# EAGLE design old_smart_nodemcu_reroute (EAGLE 7.6.0)
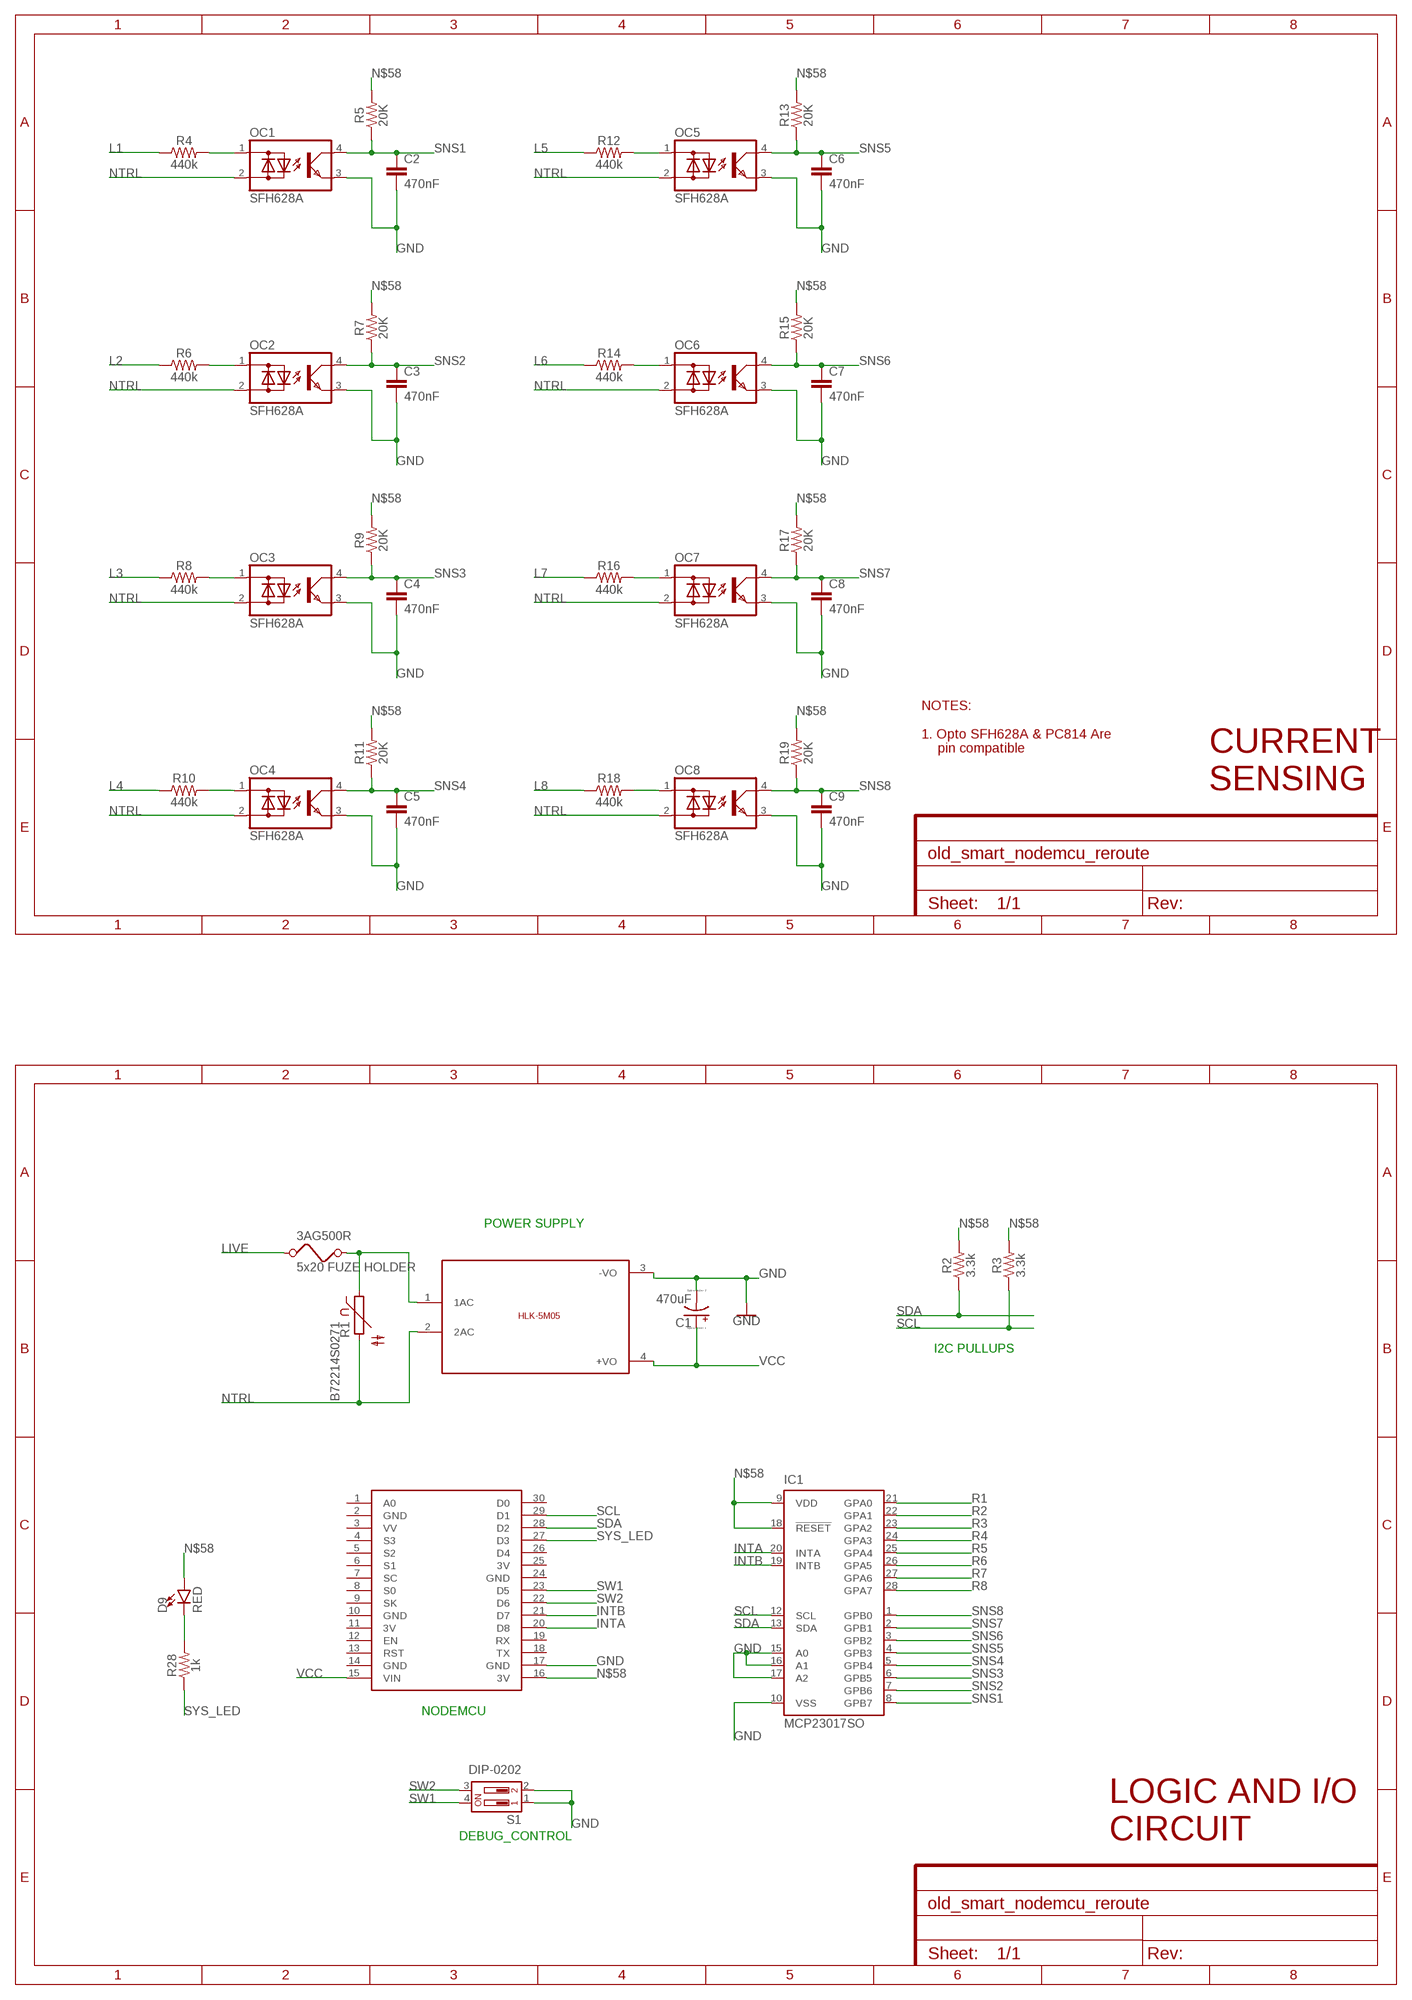
[diagram p0: schematic, sheet 1, part 1 of 2]
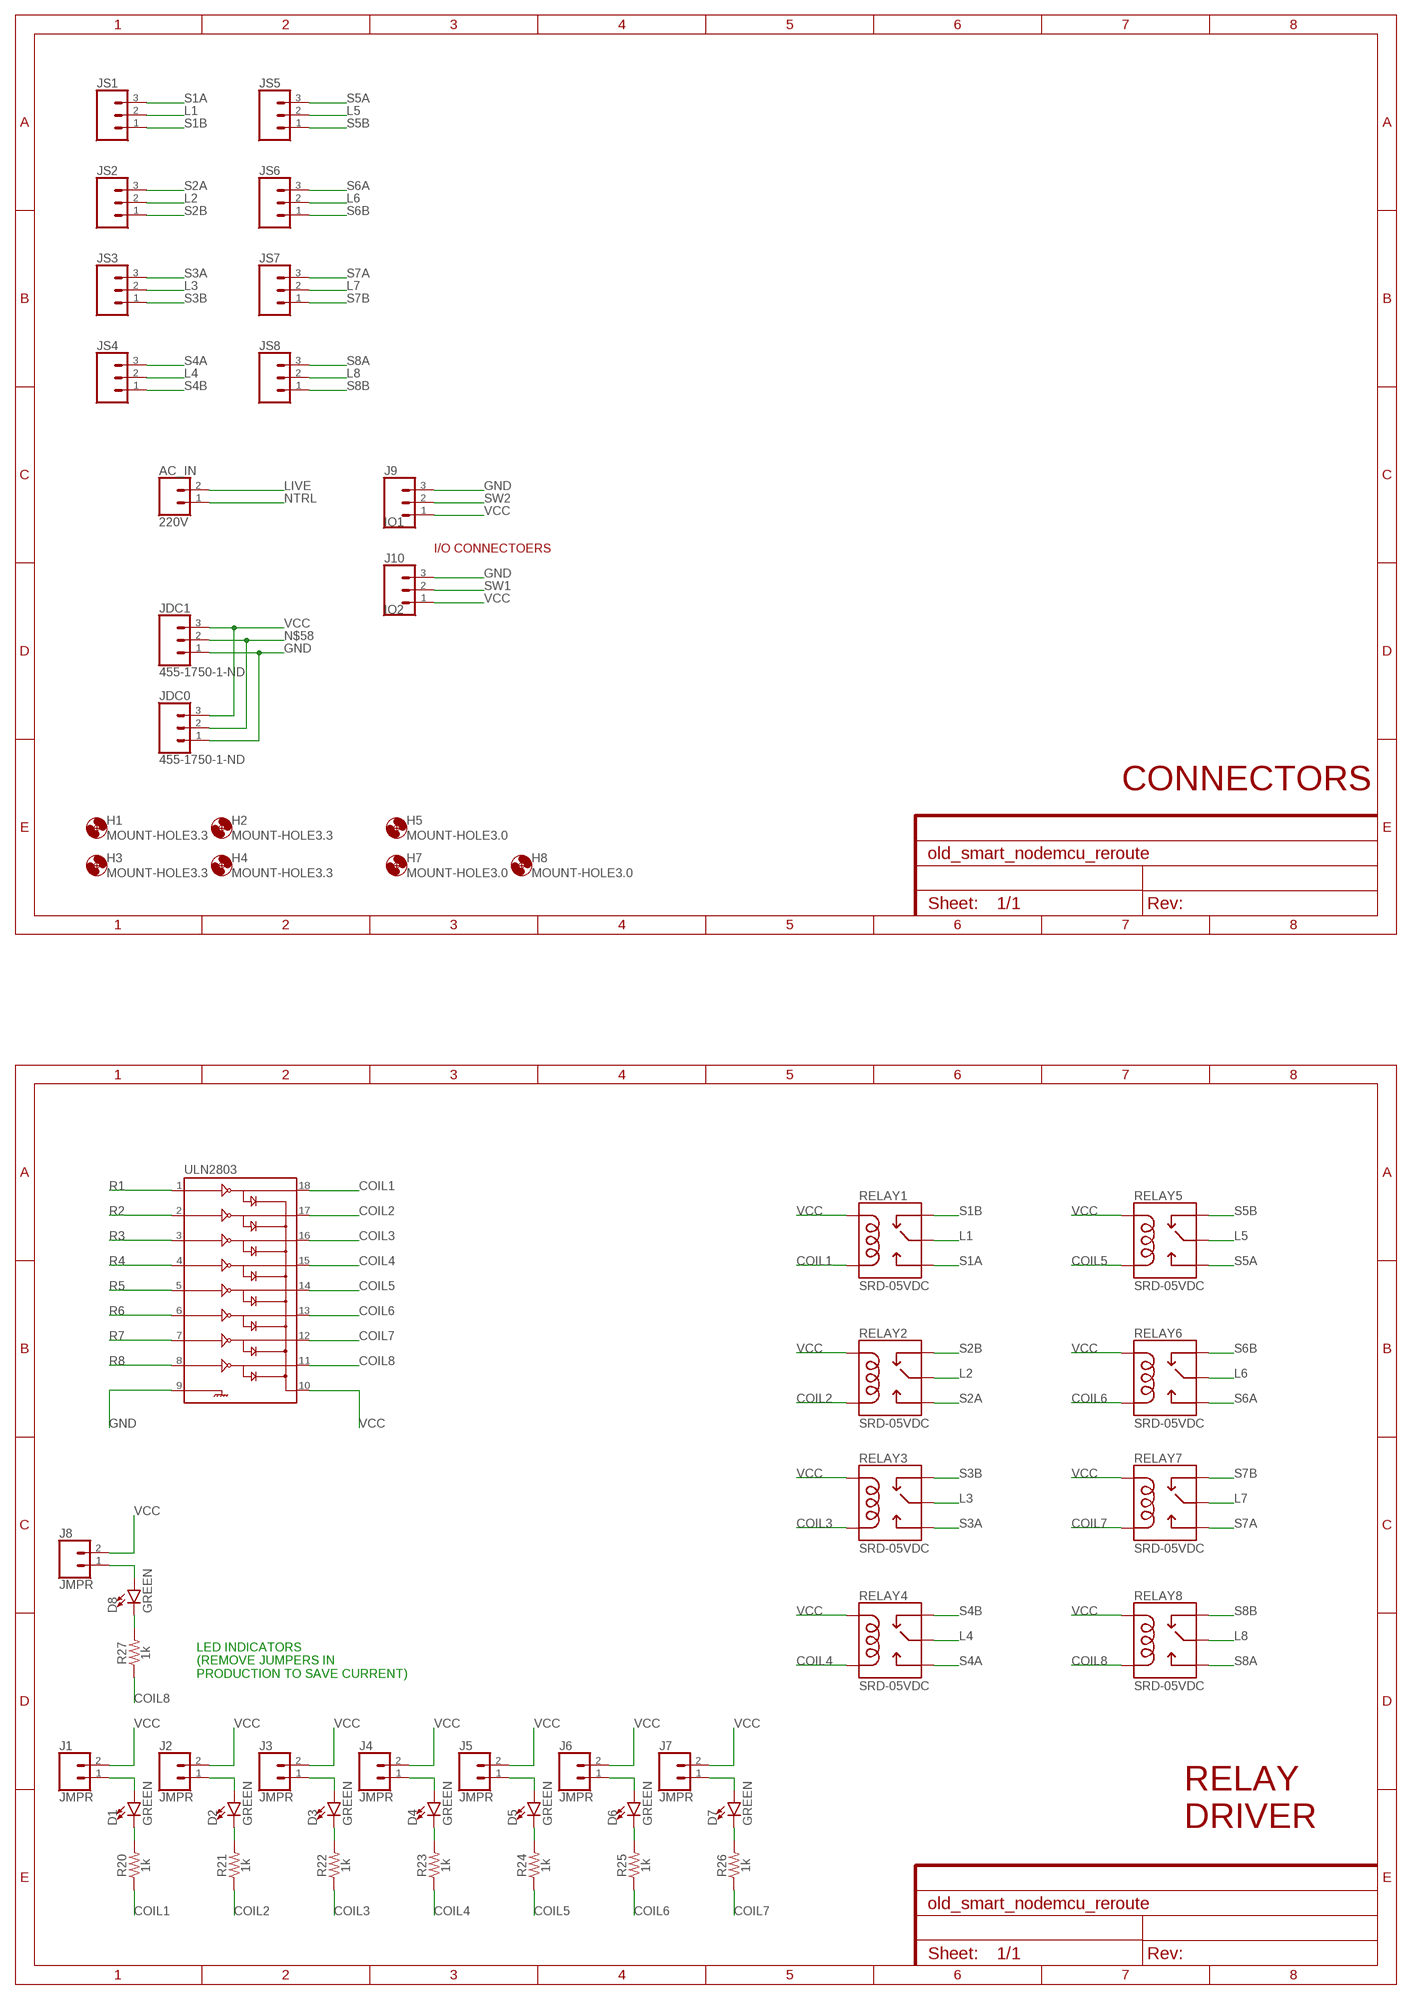
[diagram p1: schematic, sheet 1, part 2 of 2]

## Parts
3AG500R  5x20 FUZE HOLDER  FUSE  [FUSE]
AC_IN  220V  CONN_025MM  [SCREWTERMINAL-5MM-2]
C1  470uF  CPOL-USE3.5-8  [E3,5-8]
C2  470nF  470NF-0603-10V-10%-X5R  [0603]
C3  470nF  470NF-0603-10V-10%-X5R  [0603]
C4  470nF  470NF-0603-10V-10%-X5R  [0603]
C5  470nF  470NF-0603-10V-10%-X5R  [0603]
C6  470nF  470NF-0603-10V-10%-X5R  [0603]
C7  470nF  470NF-0603-10V-10%-X5R  [0603]
C8  470nF  470NF-0603-10V-10%-X5R  [0603]
C9  470nF  470NF-0603-10V-10%-X5R  [0603]
D1  GREEN  LED-GREEN0603  [LED-0603]
D2  GREEN  LED-GREEN0603  [LED-0603]
D3  GREEN  LED-GREEN0603  [LED-0603]
D4  GREEN  LED-GREEN0603  [LED-0603]
D5  GREEN  LED-GREEN0603  [LED-0603]
D6  GREEN  LED-GREEN0603  [LED-0603]
D7  GREEN  LED-GREEN0603  [LED-0603]
D8  GREEN  LED-GREEN0603  [LED-0603]
D9  RED  LED-RED0603  [LED-0603]
H1  MOUNT-HOLE3.3  [3,3]
H2  MOUNT-HOLE3.3  [3,3]
H3  MOUNT-HOLE3.3  [3,3]
H4  MOUNT-HOLE3.3  [3,3]
H5  MOUNT-HOLE3.0  [3,0]
H7  MOUNT-HOLE3.0  [3,0]
H8  MOUNT-HOLE3.0  [3,0]
IC1  MCP23017SO  [SO28W]
J1  JMPR  CONN_02  [1X02]
J2  JMPR  CONN_02  [1X02]
J3  JMPR  CONN_02  [1X02]
J4  JMPR  CONN_02  [1X02]
J5  JMPR  CONN_02  [1X02]
J6  JMPR  CONN_02  [1X02]
J7  JMPR  CONN_02  [1X02]
J8  JMPR  CONN_02  [1X02]
J9  IO1  CONN_03  [1X03]
J10  IO2  CONN_03  [1X03]
JDC0  455-1750-1-ND  CONN_03  [1X03]
JDC1  455-1750-1-ND  CONN_03  [1X03]
JS1  CONN_03-SCREW-5MM  [SCREWTERMINAL-5MM-3]
JS2  CONN_03-SCREW-5MM  [SCREWTERMINAL-5MM-3]
JS3  CONN_03-SCREW-5MM  [SCREWTERMINAL-5MM-3]
JS4  CONN_03-SCREW-5MM  [SCREWTERMINAL-5MM-3]
JS5  CONN_03-SCREW-5MM  [SCREWTERMINAL-5MM-3]
JS6  CONN_03-SCREW-5MM  [SCREWTERMINAL-5MM-3]
JS7  CONN_03-SCREW-5MM  [SCREWTERMINAL-5MM-3]
JS8  CONN_03-SCREW-5MM  [SCREWTERMINAL-5MM-3]
NODEMCU  NODEMCU  [NODEMCU]
OC1  SFH628A  SFH6206  [DIL4-SMD]
OC2  SFH628A  SFH6206  [DIL4-SMD]
OC3  SFH628A  SFH6206  [DIL4-SMD]
OC4  SFH628A  SFH6206  [DIL4-SMD]
OC5  SFH628A  SFH6206  [DIL4-SMD]
OC6  SFH628A  SFH6206  [DIL4-SMD]
OC7  SFH628A  SFH6206  [DIL4-SMD]
OC8  SFH628A  SFH6206  [DIL4-SMD]
R1  B72214S0271  P592  [P592]
R2  3.3k  3.3KOHM-0603-1/10W-1%  [0603]
R3  3.3k  3.3KOHM-0603-1/10W-1%  [0603]
R4  440k  RESISTOR0805  [0805]
R5  20K  10KOHM-0603-1/10W-1%  [0603]
R6  440k  RESISTOR0805  [0805]
R7  20K  10KOHM-0603-1/10W-1%  [0603]
R8  440k  RESISTOR0805  [0805]
R9  20K  10KOHM-0603-1/10W-1%  [0603]
R10  440k  RESISTOR0805  [0805]
R11  20K  10KOHM-0603-1/10W-1%  [0603]
R12  440k  RESISTOR0805  [0805]
R13  20K  10KOHM-0603-1/10W-1%  [0603]
R14  440k  RESISTOR0805  [0805]
R15  20K  10KOHM-0603-1/10W-1%  [0603]
R16  440k  RESISTOR0805  [0805]
R17  20K  10KOHM-0603-1/10W-1%  [0603]
R18  440k  RESISTOR0805  [0805]
R19  20K  10KOHM-0603-1/10W-1%  [0603]
R20  1k  1KOHM-0603-1/10W-1%  [0603]
R21  1k  1KOHM-0603-1/10W-1%  [0603]
R22  1k  1KOHM-0603-1/10W-1%  [0603]
R23  1k  1KOHM-0603-1/10W-1%  [0603]
R24  1k  1KOHM-0603-1/10W-1%  [0603]
R25  1k  1KOHM-0603-1/10W-1%  [0603]
R26  1k  1KOHM-0603-1/10W-1%  [0603]
R27  1k  1KOHM-0603-1/10W-1%  [0603]
R28  1k  1KOHM-0603-1/10W-1%  [0603]
RELAY1  SRD-05VDC  RELAYPTH  [SRD-05VDC-SL-C]
RELAY2  SRD-05VDC  RELAYPTH  [SRD-05VDC-SL-C]
RELAY3  SRD-05VDC  RELAYPTH  [SRD-05VDC-SL-C]
RELAY4  SRD-05VDC  RELAYPTH  [SRD-05VDC-SL-C]
RELAY5  SRD-05VDC  RELAYPTH  [SRD-05VDC-SL-C]
RELAY6  SRD-05VDC  RELAYPTH  [SRD-05VDC-SL-C]
RELAY7  SRD-05VDC  RELAYPTH  [SRD-05VDC-SL-C]
RELAY8  SRD-05VDC  RELAYPTH  [SRD-05VDC-SL-C]
S1  DIP-0202  [DIPSWITCH-02]
U$1  5VDC/5W  HLK-5M05  [HLK-5M05]
ULN2803  ULN2803SOICW  [SO18L]

## Nets
COIL1: R20.1 RELAY1.COIL0 ULN2803.18
COIL2: R21.1 RELAY2.COIL0 ULN2803.17
COIL3: R22.1 RELAY3.COIL0 ULN2803.16
COIL4: R23.1 RELAY4.COIL0 ULN2803.15
COIL5: R24.1 RELAY5.COIL0 ULN2803.14
COIL6: R25.1 RELAY6.COIL0 ULN2803.13
COIL7: R26.1 RELAY7.COIL0 ULN2803.12
COIL8: R27.1 RELAY8.COIL0 ULN2803.11
GND: C1.- C2.2 C3.2 C4.2 C5.2 C6.2 C7.2 C8.2 C9.2 IC1.10(VSS) IC1.15(A0) IC1.16(A1) IC1.17(A2) J9.3 J10.3 JDC0.1 JDC1.1 NODEMCU.17(GND) OC1.3(E) OC2.3(E) OC3.3(E) OC4.3(E) OC5.3(E) OC6.3(E) OC7.3(E) OC8.3(E) S1.1 S1.2 U$1.3(-VO) ULN2803.9
INTA: IC1.20(INTA) NODEMCU.20(D8)
INTB: IC1.19(INTB) NODEMCU.21(D7)
L1: JS1.2 R4.1 RELAY1.SWCOMMON
L2: JS2.2 R6.1 RELAY2.SWCOMMON
L3: JS3.2 R8.1 RELAY3.SWCOMMON
L4: JS4.2 R10.1 RELAY4.SWCOMMON
L5: JS5.2 R12.1 RELAY5.SWCOMMON
L6: JS6.2 R14.1 RELAY6.SWCOMMON
L7: JS7.2 R16.1 RELAY7.SWCOMMON
L8: JS8.2 R18.1 RELAY8.SWCOMMON
LIVE: 3AG500R.1 AC_IN.2
LIVE_FUSE: 3AG500R.2 R1.1 U$1.1(1AC)
N$1: OC1.1(AC1) R4.2
N$2: OC2.1(AC1) R6.2
N$3: OC3.1(AC1) R8.2
N$5: D1.A J1.1
N$6: OC5.1(AC1) R12.2
N$7: OC6.1(AC1) R14.2
N$8: OC7.1(AC1) R16.2
N$9: OC4.1(AC1) R10.2
N$10: OC8.1(AC1) R18.2
N$11: D1.C R20.2
N$12: D2.A J2.1
N$13: D2.C R21.2
N$14: D3.A J3.1
N$15: D3.C R22.2
N$16: D4.A J4.1
N$17: D4.C R23.2
N$18: D5.A J5.1
N$19: D5.C R24.2
N$20: D6.A J6.1
N$21: D6.C R25.2
N$22: D7.A J7.1
N$23: D7.C R26.2
N$24: D8.A J8.1
N$25: D8.C R27.2
N$26: D9.C R28.2
N$58: D9.A IC1.9(VDD) IC1.18(!RESET) JDC0.2 JDC1.2 NODEMCU.16(3V) R2.2 R3.2 R5.2 R7.2 R9.2 R11.2 R13.2 R15.2 R17.2 R19.2
NTRL: AC_IN.1 OC1.2(AC2) OC2.2(AC2) OC3.2(AC2) OC4.2(AC2) OC5.2(AC2) OC6.2(AC2) OC7.2(AC2) OC8.2(AC2) R1.2 U$1.2(2AC)
R1: IC1.21(GPA0) ULN2803.1
R2: IC1.22(GPA1) ULN2803.2
R3: IC1.23(GPA2) ULN2803.3
R4: IC1.24(GPA3) ULN2803.4
R5: IC1.25(GPA4) ULN2803.5
R6: IC1.26(GPA5) ULN2803.6
R7: IC1.27(GPA6) ULN2803.7
R8: IC1.28(GPA7) ULN2803.8
S1A: JS1.3 RELAY1.SWOPEN
S1B: JS1.1 RELAY1.SWCLOSED(SWCLOSE)
S2A: JS2.3 RELAY2.SWOPEN
S2B: JS2.1 RELAY2.SWCLOSED(SWCLOSE)
S3A: JS3.3 RELAY3.SWOPEN
S3B: JS3.1 RELAY3.SWCLOSED(SWCLOSE)
S4A: JS4.3 RELAY4.SWOPEN
S4B: JS4.1 RELAY4.SWCLOSED(SWCLOSE)
S5A: JS5.3 RELAY5.SWOPEN
S5B: JS5.1 RELAY5.SWCLOSED(SWCLOSE)
S6A: JS6.3 RELAY6.SWOPEN
S6B: JS6.1 RELAY6.SWCLOSED(SWCLOSE)
S7A: JS7.3 RELAY7.SWOPEN
S7B: JS7.1 RELAY7.SWCLOSED(SWCLOSE)
S8A: JS8.3 RELAY8.SWOPEN
S8B: JS8.1 RELAY8.SWCLOSED(SWCLOSE)
SCL: IC1.12(SCL) NODEMCU.29(D1) R3.1
SDA: IC1.13(SDA) NODEMCU.28(D2) R2.1
SNS1: C2.1 IC1.8(GPB7) OC1.4(C) R5.1
SNS2: C3.1 IC1.7(GPB6) OC2.4(C) R7.1
SNS3: C4.1 IC1.6(GPB5) OC3.4(C) R9.1
SNS4: C5.1 IC1.5(GPB4) OC4.4(C) R11.1
SNS5: C6.1 IC1.4(GPB3) OC5.4(C) R13.1
SNS6: C7.1 IC1.3(GPB2) OC6.4(C) R15.1
SNS7: C8.1 IC1.2(GPB1) OC7.4(C) R17.1
SNS8: C9.1 IC1.1(GPB0) OC8.4(C) R19.1
SW1: J10.2 NODEMCU.23(D5) S1.4
SW2: J9.2 NODEMCU.22(D6) S1.3
SYS_LED: NODEMCU.27(D3) R28.1
VCC: C1.+ J1.2 J2.2 J3.2 J4.2 J5.2 J6.2 J7.2 J8.2 J9.1 J10.1 JDC0.3 JDC1.3 NODEMCU.15(VIN) RELAY1.COIL1 RELAY2.COIL1 RELAY3.COIL1 RELAY4.COIL1 RELAY5.COIL1 RELAY6.COIL1 RELAY7.COIL1 RELAY8.COIL1 U$1.4(+VO) ULN2803.10
Unconnected: NODEMCU.1(A0) NODEMCU.3(VV) NODEMCU.4(S3) NODEMCU.5(S2) NODEMCU.6(S1) NODEMCU.7(SC) NODEMCU.8(S0) NODEMCU.9(SK) NODEMCU.12(EN) NODEMCU.13(RST) NODEMCU.18(TX) NODEMCU.19(RX) NODEMCU.26(D4) NODEMCU.30(D0)

## Notes on the sheet
- I/O CONNECTOERS
- NOTES:
  
  1. Opto SFH628A & PC814 Are
      pin compatible
- CURRENT
  SENSING
- CONNECTORS
- POWER SUPPLY
- I2C PULLUPS
- LED INDICATORS
  (REMOVE JUMPERS IN 
  PRODUCTION TO SAVE CURRENT)
- NODEMCU
- RELAY
  DRIVER
- DEBUG_CONTROL
- LOGIC AND I/O
  CIRCUIT

## Power pins joined to a net without a drawn wire
3V: NODEMCU.11(3V) NODEMCU.25(3V)
GND: NODEMCU.2(GND) NODEMCU.10(GND) NODEMCU.14(GND) NODEMCU.24(GND)

## Library data of the parts
3AG500R = special:FUSE: FUSE 5 x 20 mm
AC_IN = SparkFun-Connectors:CONN_02: Multi connection point. Often used as Generic Header-pin footprint for 0.1 inch spaced/style header connections On any of the 0.1 inch spaced packages, you can populate with these: Break Away Headers - Straight <https://www.sparkfun.com/products/116> (PRT-00116) Break Away Male Headers - Right Angle <https://www.sparkfun.com/products/553> (PRT-00553) Female Headers <https://www.sparkfun.com/products/115> (PRT-00115) Break Away Headers - Machine Pin <https://www.sparkfun.com/products/117> (PRT-00117) Break Away Female Headers - Swiss Machine Pin <https://www.sparkfun.com/products/743> (PRT-00743) For SCREWTERMINALS and SPRING TERMINALS visit here: Screw Terimnals on SparkFun.com <https://www.sparkfun.com/search/results?term=Screw+Terminals> (5mm/3.5mm/2.54mm spacing) This device is also useful as a general connection point to wire up your design to another part of your project. Our various solder wires solder well into these plated through hole pads. Hook-Up Wire - Assortment (Stranded, 22 AWG) <https://www.sparkfun.com/products/11375> (PRT-11375) Hook-Up Wire - Assortment (Solid Core, 22 AWG) <https://www.sparkfun.com/products/11367> (PRT-11367) View the entire wire category on our website here <https://www.sparkfun.com/categories/141> Special notes: Molex polarized connector foot print use with: PRT-08233 with associated crimp pins and housings. 2.54_SCREWTERM for use with PRT-10571. 3.5mm Screw Terminal footprints for PRT-08084 5mm Screw Terminal footprints for use with PRT-08432; SF_SKU: PRT-08432
C1 = resistor:CPOL-US: POLARIZED CAPACITOR, American symbol
C2-C9 = SparkFun-Capacitors:470NF: 0.47uF/470nF ceramic capacitors A capacitor is a passive two-terminal electrical component used to store electrical energy temporarily in an electric field.; PROD_ID: CAP-13216
D1-D8 = SparkFun-LED:LED-GREEN: Green SMD LED Used in manufacturing of various products at SparkFun Packages: 0603 - SMD 0603 package [Product Link] <http://www.futureelectronics.com/en/technologies/semiconductors/optoelectronics/leds/Pages/9894312-LTST-C190GKT.aspx?CrossPart=HSMG-C190&IM=0> LilyPad 1206 - SMD1206 LilyPad package [Product Link] <http://www.futureelectronics.com/en/Technologies/Product.aspx?ProductID=IN150NGHARVATEKCORPORATION2049943&IM=0> 1206 - SMD1206 package [Product Link] <http://www.futureelectronics.com/en/technologies/semiconductors/optoelectronics/leds/Pages/8315665-LTST-C150KGKT.aspx?IM=0> 1206 Bottom Mount -SMD 1206 Bottom Mount [Product Link] <http://www.digikey.com/product-detail/en/lite-on-inc/LTST-C230KGKT/160-1456-1-ND/386854> SparkFun Products: Pro Mini 328 -5V <https://www.sparkfun.com/products/821> RedBoard <https://www.sparkfun.com/products/12757> MP3 Trigger <https://www.sparkfun.com/products/13720> Makey Makey <https://www.sparkfun.com/products/11076>; PROD_ID: DIO-00821
D9 = SparkFun-LED:LED-RED: Red SMD LED Used in manufacturing of most products at SparkFun Packages: 0603 - SMD 0603 package [Product Link] <http://docs.avagotech.com/docs/AV02-0551EN> 0603 SMART - SMD 0603 SMART package ( more efficient and expensive)[Product Link] <http://www.osram-os.com/Graphics/XPic2/00077099_0.pdf> 1206 - SMD1206 package [Product Link] <https://www.sparkfun.com/datasheets/DevTools/LilyPad/Q150OVS4.pdff> SparkFun Products: Pro Mini 328 -5V <https://www.sparkfun.com/products/821> RedBoard <https://www.sparkfun.com/products/12757> IOIO-OTG <https://www.sparkfun.com/products/13613>; PROD_ID: DIO-00819
H1-H5 H7 H8 = holes:MOUNT-HOLE: MOUNTING HOLE with drill center marker
IC1 = microchip:MCP23017: http://ww1.microchip.com/downloads/en/DeviceDoc/21952a.pdf Source: http://ww1.microchip.com/downloads/en/DeviceDoc/21952a.pdf; MF: MICROCHIP; MPN: MCP23017-E/SO; OC_FARNELL: 1332087; OC_NEWARK: 31K2958
J1-J8 = SparkFun-Connectors:CONN_02: Multi connection point. Often used as Generic Header-pin footprint for 0.1 inch spaced/style header connections On any of the 0.1 inch spaced packages, you can populate with these: Break Away Headers - Straight <https://www.sparkfun.com/products/116> (PRT-00116) Break Away Male Headers - Right Angle <https://www.sparkfun.com/products/553> (PRT-00553) Female Headers <https://www.sparkfun.com/products/115> (PRT-00115) Break Away Headers - Machine Pin <https://www.sparkfun.com/products/117> (PRT-00117) Break Away Female Headers - Swiss Machine Pin <https://www.sparkfun.com/products/743> (PRT-00743) For SCREWTERMINALS and SPRING TERMINALS visit here: Screw Terimnals on SparkFun.com <https://www.sparkfun.com/search/results?term=Screw+Terminals> (5mm/3.5mm/2.54mm spacing) This device is also useful as a general connection point to wire up your design to another part of your project. Our various solder wires solder well into these plated through hole pads. Hook-Up Wire - Assortment (Stranded, 22 AWG) <https://www.sparkfun.com/products/11375> (PRT-11375) Hook-Up Wire - Assortment (Solid Core, 22 AWG) <https://www.sparkfun.com/products/11367> (PRT-11367) View the entire wire category on our website here <https://www.sparkfun.com/categories/141> Special notes: Molex polarized connector foot print use with: PRT-08233 with associated crimp pins and housings. 2.54_SCREWTERM for use with PRT-10571. 3.5mm Screw Terminal footprints for PRT-08084 5mm Screw Terminal footprints for use with PRT-08432
J9 J10 = SparkFun-Connectors:CONN_03: Multi connection point. Often used as Generic Header-pin footprint for 0.1 inch spaced/style header connections On any of the 0.1 inch spaced packages, you can populate with these: Break Away Headers - Straight <https://www.sparkfun.com/products/116> (PRT-00116) Break Away Male Headers - Right Angle <https://www.sparkfun.com/products/553> (PRT-00553) Female Headers <https://www.sparkfun.com/products/115> (PRT-00115) Break Away Headers - Machine Pin <https://www.sparkfun.com/products/117> (PRT-00117) Break Away Female Headers - Swiss Machine Pin <https://www.sparkfun.com/products/743> (PRT-00743) Stackable Header - 3 Pin (Female, 0.1") <https://www.sparkfun.com/products/13875> (PRT-13875) For SCREWTERMINALS and SPRING TERMINALS visit here: Screw Terimnals on SparkFun.com <https://www.sparkfun.com/search/results?term=Screw+Terminals> (5mm/3.5mm/2.54mm spacing) This device is also useful as a general connection point to wire up your design to another part of your project. Our various solder wires solder well into these plated through hole pads. Hook-Up Wire - Assortment (Stranded, 22 AWG) <https://www.sparkfun.com/products/11375> (PRT-11375) Hook-Up Wire - Assortment (Solid Core, 22 AWG) <https://www.sparkfun.com/products/11367> (PRT-11367) View the entire wire category on our website here <https://www.sparkfun.com/categories/141> Special notes: Molex polarized connector foot print use with SKU : PRT-08232 with associated crimp pins and housings.; PROD_ID: XXX-00000; VALUE: 455-1750-1-ND
JDC0 JDC1 = SparkFun-Connectors:CONN_03: Multi connection point. Often used as Generic Header-pin footprint for 0.1 inch spaced/style header connections On any of the 0.1 inch spaced packages, you can populate with these: Break Away Headers - Straight <https://www.sparkfun.com/products/116> (PRT-00116) Break Away Male Headers - Right Angle <https://www.sparkfun.com/products/553> (PRT-00553) Female Headers <https://www.sparkfun.com/products/115> (PRT-00115) Break Away Headers - Machine Pin <https://www.sparkfun.com/products/117> (PRT-00117) Break Away Female Headers - Swiss Machine Pin <https://www.sparkfun.com/products/743> (PRT-00743) Stackable Header - 3 Pin (Female, 0.1") <https://www.sparkfun.com/products/13875> (PRT-13875) For SCREWTERMINALS and SPRING TERMINALS visit here: Screw Terimnals on SparkFun.com <https://www.sparkfun.com/search/results?term=Screw+Terminals> (5mm/3.5mm/2.54mm spacing) This device is also useful as a general connection point to wire up your design to another part of your project. Our various solder wires solder well into these plated through hole pads. Hook-Up Wire - Assortment (Stranded, 22 AWG) <https://www.sparkfun.com/products/11375> (PRT-11375) Hook-Up Wire - Assortment (Solid Core, 22 AWG) <https://www.sparkfun.com/products/11367> (PRT-11367) View the entire wire category on our website here <https://www.sparkfun.com/categories/141> Special notes: Molex polarized connector foot print use with SKU : PRT-08232 with associated crimp pins and housings.; PROD_ID: XXX-00000
JS1-JS8 = SparkFun-Connectors:CONN_03: Multi connection point. Often used as Generic Header-pin footprint for 0.1 inch spaced/style header connections On any of the 0.1 inch spaced packages, you can populate with these: Break Away Headers - Straight <https://www.sparkfun.com/products/116> (PRT-00116) Break Away Male Headers - Right Angle <https://www.sparkfun.com/products/553> (PRT-00553) Female Headers <https://www.sparkfun.com/products/115> (PRT-00115) Break Away Headers - Machine Pin <https://www.sparkfun.com/products/117> (PRT-00117) Break Away Female Headers - Swiss Machine Pin <https://www.sparkfun.com/products/743> (PRT-00743) Stackable Header - 3 Pin (Female, 0.1") <https://www.sparkfun.com/products/13875> (PRT-13875) For SCREWTERMINALS and SPRING TERMINALS visit here: Screw Terimnals on SparkFun.com <https://www.sparkfun.com/search/results?term=Screw+Terminals> (5mm/3.5mm/2.54mm spacing) This device is also useful as a general connection point to wire up your design to another part of your project. Our various solder wires solder well into these plated through hole pads. Hook-Up Wire - Assortment (Stranded, 22 AWG) <https://www.sparkfun.com/products/11375> (PRT-11375) Hook-Up Wire - Assortment (Solid Core, 22 AWG) <https://www.sparkfun.com/products/11367> (PRT-11367) View the entire wire category on our website here <https://www.sparkfun.com/categories/141> Special notes: Molex polarized connector foot print use with SKU : PRT-08232 with associated crimp pins and housings.; PROD_ID: CONN-10134; SF_SKU: PRT-08433
NODEMCU = nodemcu:NODEMCU
OC1-OC8 = optocoupler:SFH620: Optocoupler, Phototransistor Output, AC Input Source: http://www.vishay.com/docs/83675/sfh620.pdf; MF: VISHAY/TELEFUNKEN; MPN: SFH6206-3; OC_FARNELL: 1469585; OC_NEWARK: 58K2214
R1 = varistor:P592: VARISTOR
R2 R3 = SparkFun-Resistors:3.3KOHM: 3.3kΩ resistor A resistor is a passive two-terminal electrical component that implements electrical resistance as a circuit element. Resistors act to reduce current flow, and, at the same time, act to lower voltage levels within circuits. - Wikipedia; PROD_ID: RES-07851
R4 R6 R8 R10 R12 R14 R16 R18 = SparkFun-Resistors:RESISTOR: Generic Resistor Package
R5 R7 R9 R11 R13 R15 R17 R19 = SparkFun-Resistors:10KOHM: 10kΩ resistor A resistor is a passive two-terminal electrical component that implements electrical resistance as a circuit element. Resistors act to reduce current flow, and, at the same time, act to lower voltage levels within circuits. - Wikipedia; PROD_ID: RES-00824; VALUE: 10k
R20-R28 = SparkFun-Resistors:1KOHM: 1kΩ resistor A resistor is a passive two-terminal electrical component that implements electrical resistance as a circuit element. Resistors act to reduce current flow, and, at the same time, act to lower voltage levels within circuits. - Wikipedia; PROD_ID: RES-07856
RELAY1-RELAY8 = SRD-05VDC:RELAY: SPDT relay (COM-00101)
S1 = SparkFun-Retired:DIP-02: SMD dip switch 2 positions
U$1 = HLK-M05:HLK-5M05: HLK-5M05 is an 5Volt/5W smps developed by HI-LINK; SIZE: 23x38(mm)
ULN2803 = SparkFun-IC-Special-Function:ULN2803: Darlington Driver(IC-07959, low stock) ULN2803 Darlington array. 500mA max per channel, 8-channel package. Spark Fun Electronics SKU : COM-00312

## Board
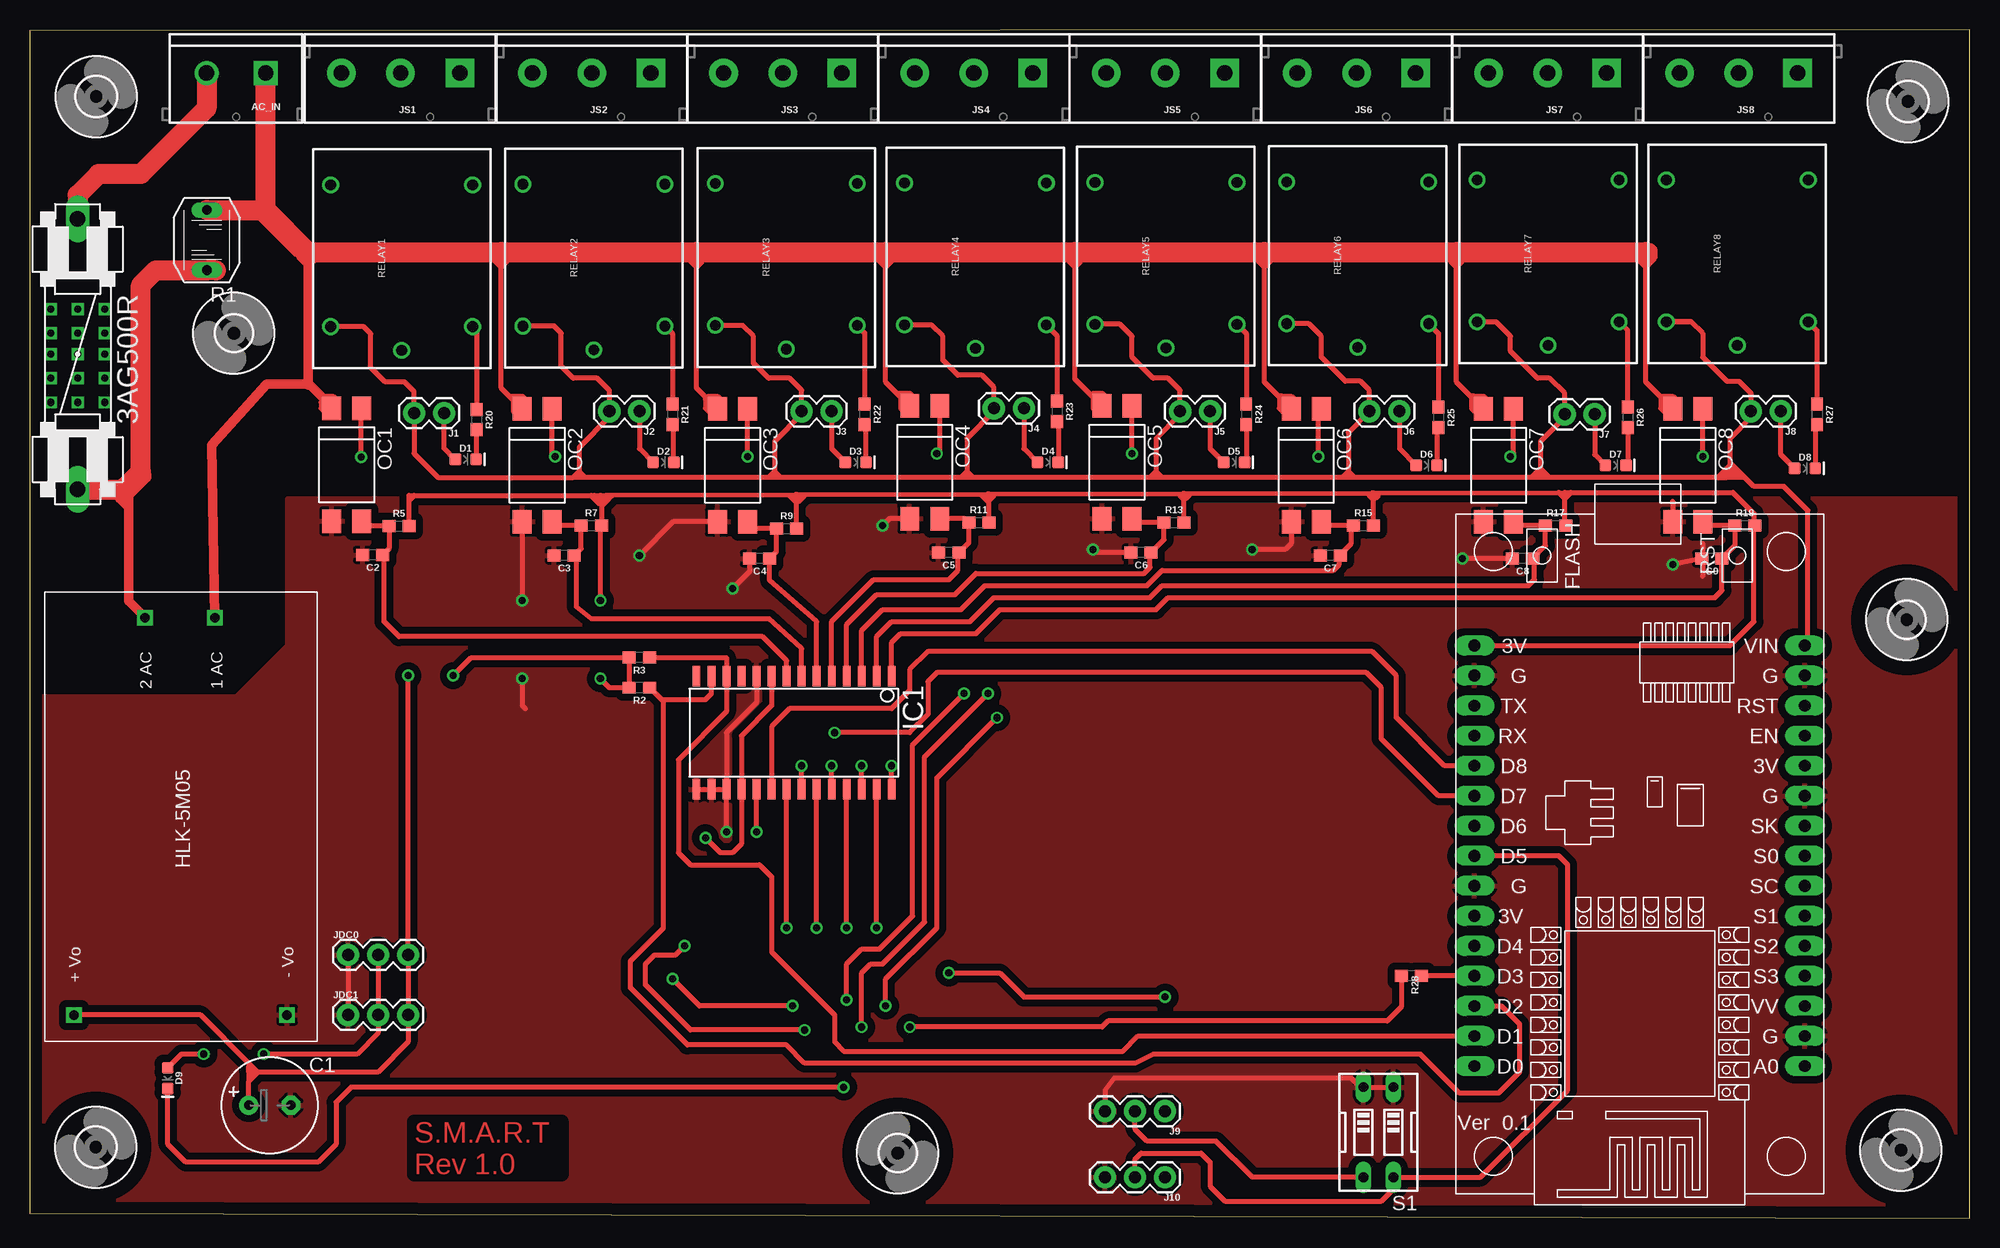
[diagram p2: board, top side]
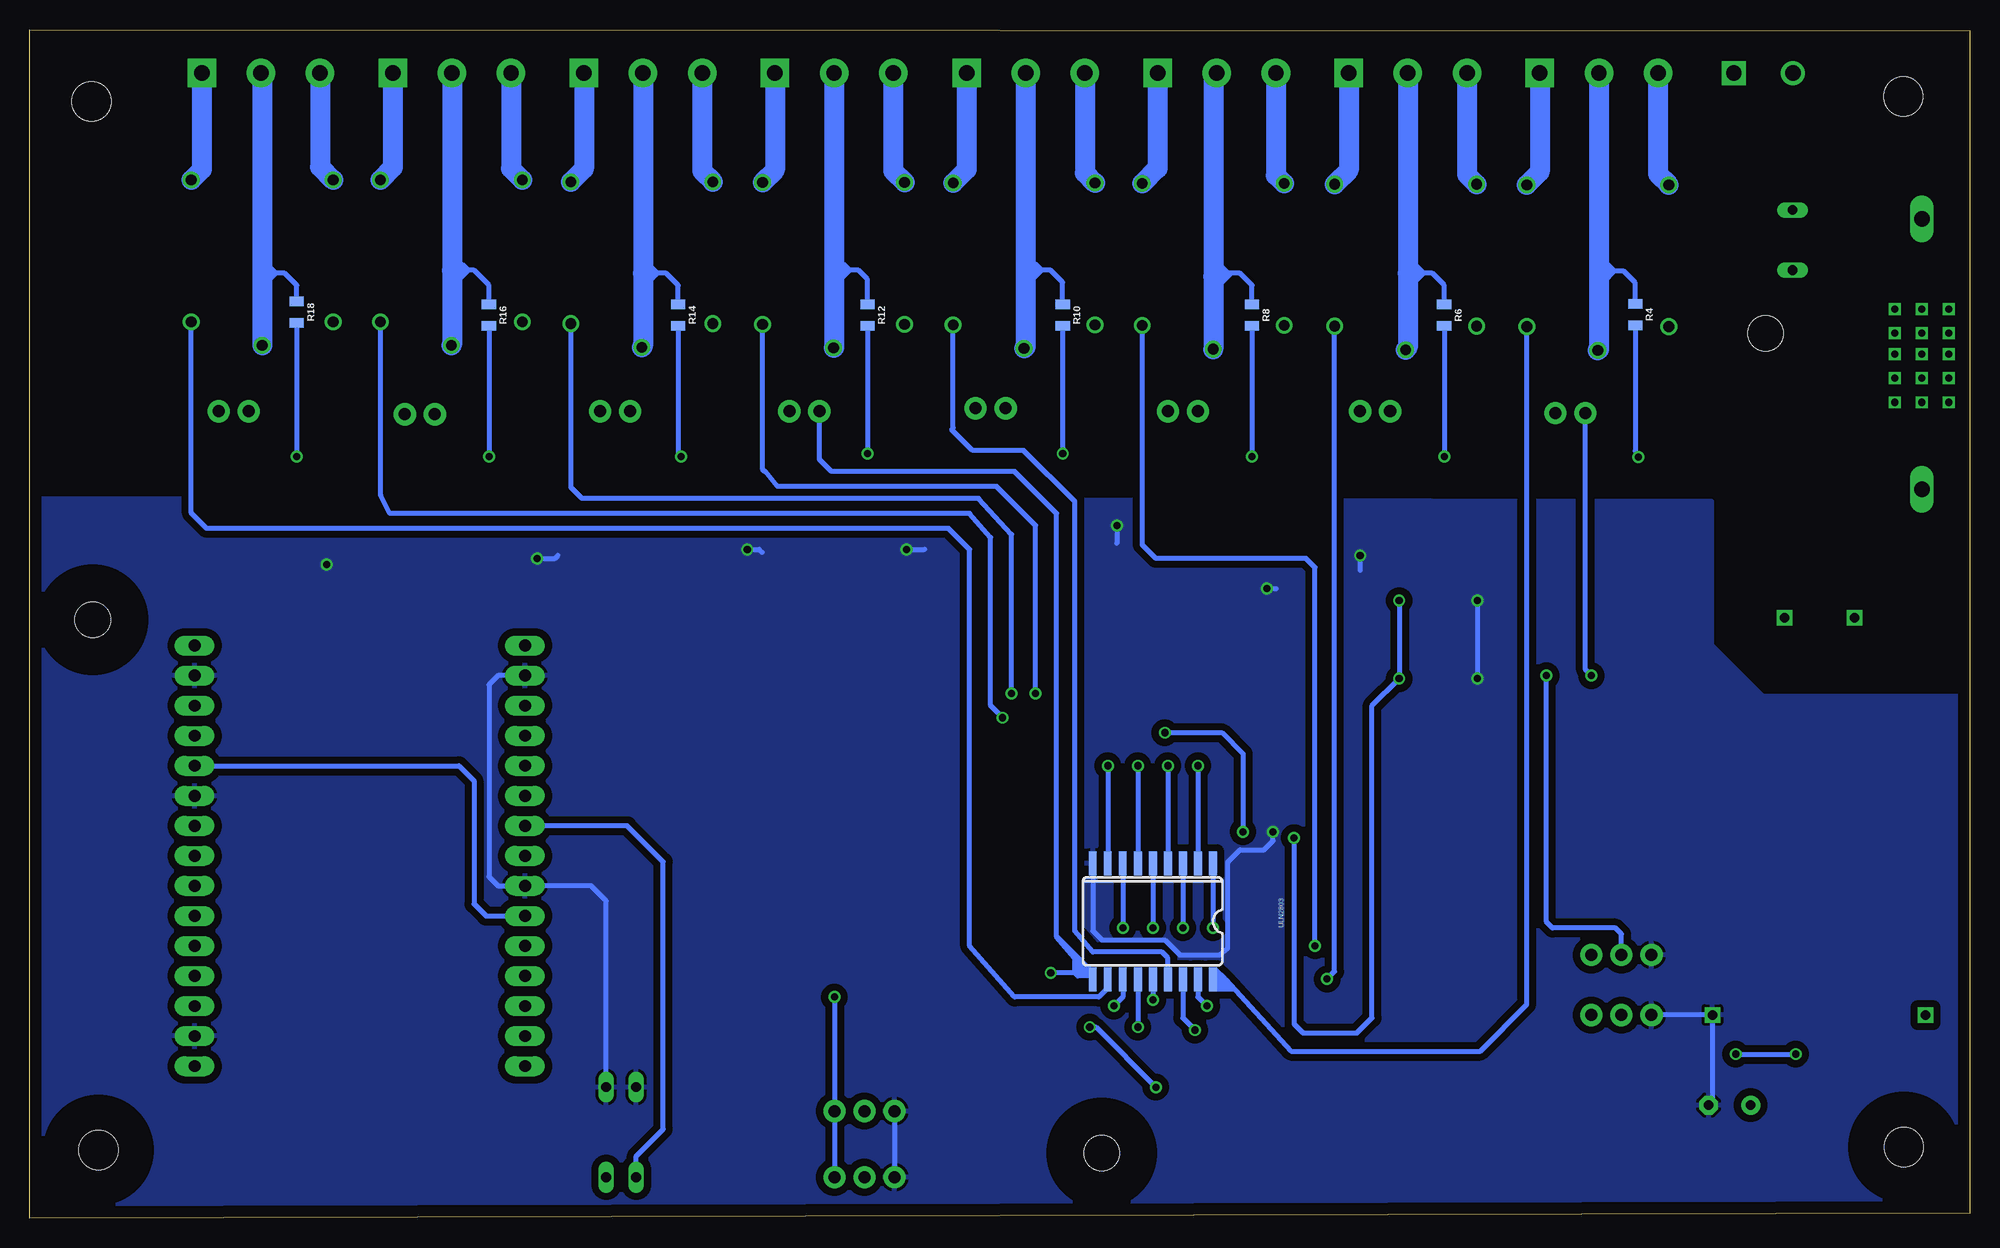
[diagram p3: board, bottom side, seen from below]

Size 164.06 x 100.51 mm. Coordinates in mm from the lower left corner, seen from the top.
Outline: 0,0.41 164.06,0 164.06,100.51 0,100.41 0,0.41
Copper layers (1*16): Top 0.035mm / dielectric 1.5mm / Bottom 0.035mm
Design rules "default": minimum track width 10mil, minimum drill 24mil, track to track 8mil, track to pad 8mil, pad to pad 8mil, via to via 8mil, smd to smd 8mil, copper to edge 40mil, drill to drill 8mil, minimum pad ring 10mil, minimum via ring 8mil, stop-mask expansion 4mil, vias tented up to drill 0mil, thermal gap 10mil

### Footprints (pad centres in the part's own frame; a part is rotated, then mirrored left to right if it is on the bottom)
FUSE = drill 1.321 long: 1 -11.43,0; 2 11.43,0
SCREWTERMINAL-5MM-2 = drill 1.3 pad 2.032 square: 1 0,0 | drill 1.3 pad 2.032: 2 5,0
E3,5-8 = drill 0.813 pad 1.6: + -1.778,0 | drill 0.813 pad 1.6 octagon: - 1.778,0
0603 = smd 1.1 x 1: 1 -0.85,0; 2 0.85,0
LED-0603 = smd 1 x 1: A -0.877,0; C 0.877,0
3,3 = hole 3.3: 0,0
3,0 = hole 3: 0,0
SO28W = smd 0.65 x 1.7: 1 -7.62,-4.78; 2 -6.35,-4.78; 3 -5.08,-4.78; 4 -3.81,-4.78; 5 -2.54,-4.78; 6 -1.27,-4.78; 7 0,-4.78; 8 1.27,-4.78; 9 2.54,-4.78; 10 3.81,-4.78; 11 5.08,-4.78; 12 6.35,-4.78; 13 7.62,-4.78; 14 8.89,-4.78; 15 8.89,4.78; 16 7.62,4.78; 17 6.35,4.78; 18 5.08,4.78; 19 3.81,4.78; 20 2.54,4.78; 21 1.27,4.78; 22 0,4.78; 23 -1.27,4.78; 24 -2.54,4.78; 25 -3.81,4.78; 26 -5.08,4.78; 27 -6.35,4.78; 28 -7.62,4.78
1X02 = drill 1.016 pad 1.88: 1 0,0; 2 2.54,0
1X03 = drill 1.016 pad 1.88: 1 0,0; 2 2.54,0; 3 5.08,0
SCREWTERMINAL-5MM-3 = drill 1.3 pad 2.413 square: 1 0,0 | drill 1.3 pad 2.413: 2 5,0; 3 10,0
NODEMCU = drill 1 pad 1.676 long: 1 -13.97,17.78; 2 -13.97,15.24; 3 -13.97,12.7; 4 -13.97,10.16; 5 -13.97,7.62; 6 -13.97,5.08; 7 -13.97,2.54; 8 -13.97,0; 9 -13.97,-2.54; 10 -13.97,-5.08; 11 -13.97,-7.62; 12 -13.97,-10.16; 13 -13.97,-12.7; 14 -13.97,-15.24; 15 -13.97,-17.78; 16 13.97,-17.78; 17 13.97,-15.24; 18 13.97,-12.7; 19 13.97,-10.16; 20 13.97,-7.62; 21 13.97,-5.08; 22 13.97,-2.54; 23 13.97,0; 24 13.97,2.54; 25 13.97,5.08; 26 13.97,7.62; 27 13.97,10.16; 28 13.97,12.7; 29 13.97,15.24; 30 13.97,17.78
DIL4-SMD = smd 1.6 x 2: 1 -1.27,-4.77; 2 1.27,-4.77; 3 1.27,4.77; 4 -1.27,4.77
P592 = drill 0.813 long: 1 0,2.54; 2 0,-2.54
0805 = smd 0.8 x 1.2: 1 -0.9,0; 2 0.9,0
SRD-05VDC-SL-C = drill 0.9: COIL0 -5.39,-6.12; COIL1 -5.39,5.88; SWCLOSED 6.61,-6.12; SWCOMMON -7.39,-0.12; SWOPEN 6.61,5.88
DIPSWITCH-02 = drill 0.813 long: 1 -1.27,-3.81; 2 1.27,-3.81; 3 1.27,3.81; 4 -1.27,3.81
HLK-5M05 = drill 0.8 square: 1 -16.85,-2.93; 2 -16.85,2.97; 3 16.75,9.07; 4 16.75,-8.93
SO18L = smd 0.66 x 2.032: 1 -0.635,-4.902; 2 0.635,-4.902; 3 1.905,-4.902; 4 3.175,-4.902; 5 4.445,-4.902; 6 5.715,-4.902; 7 6.985,-4.902; 8 8.255,-4.902; 9 9.525,-4.902; 10 9.525,4.902; 11 8.255,4.902; 12 6.985,4.902; 13 5.715,4.902; 14 4.445,4.902; 15 3.175,4.902; 16 1.905,4.902; 17 0.635,4.902; 18 -0.635,4.902

### Placement (x,y rotation side)
3AG500R  4.06,73.05 270 top
AC_IN  19.96,96.82 180 top
C1  20.32,9.55 0 top
C2  29.01,56.08 180 top
C3  45.21,56.03 180 top
C4  61.72,55.78 180 top
C5  77.72,56.29 180 top
C6  93.98,56.29 180 top
C7  109.98,56.03 180 top
C8  126.24,55.78 180 top
C9  142.24,55.78 180 top
D1  36.88,64.16 0 top
D2  53.59,63.91 0 top
D3  69.85,63.91 0 top
D4  86.11,63.91 0 top
D5  101.85,63.91 0 top
D6  118.11,63.65 0 top
D7  134.11,63.65 0 top
D8  150.11,63.4 0 top
D9  11.68,11.84 270 top
H1  158.23,5.75 0 top
H2  5.6,6 0 top
H3  158.83,94.42 0 top
H4  5.64,94.84 0 top
H5  17.27,74.83 0 top
H7  73.41,5.5 90 top
H8  158.73,50.61 0 top
IC1  65.28,41.05 180 top
J1  35.05,68.07 180 top
J2  51.56,68.22 180 top
J3  67.82,68.22 180 top
J4  84.07,68.48 180 top
J5  99.82,68.22 180 top
J6  115.82,68.22 180 top
J7  132.33,67.97 180 top
J8  148.08,68.22 180 top
J9  96.01,9.04 180 top
J10  96.01,3.45 180 top
JDC0  26.92,22.25 0 top
JDC1  26.92,17.17 0 top
JS1  36.37,96.82 180 top
JS2  52.53,96.82 180 top
JS3  68.68,96.82 180 top
JS4  84.84,96.82 180 top
JS5  101.04,96.82 180 top
JS6  117.2,96.82 180 top
JS7  133.35,96.82 180 top
JS8  149.5,96.82 180 top
NODEMCU  136.14,30.63 180 top
OC1  26.82,63.7 180 top
OC2  42.93,63.65 180 top
OC3  59.44,63.65 180 top
OC4  75.69,63.91 180 top
OC5  91.95,63.91 180 top
OC6  107.95,63.65 180 top
OC7  124.21,63.65 180 top
OC8  140.21,63.65 180 top
R1  14.99,82.7 180 top
R2  51.56,44.86 180 top
R3  51.56,47.4 180 top
R4  28.3,76.4 270 bottom
R5  31.24,58.52 0 top
R6  44.45,76.35 270 bottom
R7  47.5,58.57 0 top
R8  60.71,76.35 270 bottom
R9  64.01,58.32 0 top
R10  76.71,76.35 270 bottom
R11  80.26,58.83 0 top
R12  93.22,76.35 270 bottom
R13  96.77,58.83 0 top
R14  109.22,76.35 270 bottom
R15  112.78,58.57 0 top
R16  125.22,76.35 270 bottom
R17  129.03,58.57 0 top
R18  141.48,76.61 270 bottom
R19  145.03,58.57 0 top
R20  37.8,67.51 270 top
R21  54.36,67.97 270 top
R22  70.61,67.97 270 top
R23  86.87,68.22 270 top
R24  102.87,67.97 270 top
R25  119.13,67.72 270 top
R26  135.13,67.72 270 top
R27  151.13,67.97 270 top
R28  116.84,20.47 180 top
RELAY1  31.34,80.77 90 top
RELAY2  47.6,80.82 90 top
RELAY3  63.86,80.87 90 top
RELAY4  79.86,80.92 90 top
RELAY5  95.96,80.98 90 top
RELAY6  112.17,81.03 90 top
RELAY7  128.27,81.18 90 top
RELAY8  144.27,81.18 90 top
S1  114.05,7.26 180 top
U$1  12.7,33.93 270 top
ULN2803  64.64,25.1 180 bottom

### Tracks (layer width: path | path; a pad name or v marks a point on that pad's centre or on a via)
3V
  Bottom 0.406: NODEMCU.11 127.76,38.25 126.49,36.98 126.49,26.57 125.48,25.55 NODEMCU.25
COIL1
  Top 0.406: RELAY1.COIL0 37.8,75.05 R20.1
  Bottom 0.406: ULN2803.18 62.97,20.19 62.97,20.17 57.41,14.12 41.4,14.12 37.46,18.06 RELAY1.COIL0
COIL2  (via drill 0.6)
  Top 0.406: RELAY2.COIL0 54.36,74.8 R21.1 | v64.52,17.93 56.64,17.93 v54.36,20.22
  Bottom 0.406: ULN2803.17 65.28,18.69 v64.52,17.93 | v54.36,20.22 53.72,20.85 RELAY2.COIL0
COIL3  (via drill 0.6)
  Top 0.406: RELAY3.COIL0 70.61,74.85 R22.1 | v65.53,15.9 55.88,15.9 52.07,19.71 52.07,21.49 52.83,22.25 54.61,22.25 v55.37,23.01
  Bottom 0.406: ULN2803.16 66.55,16.92 v65.53,15.9 | v55.37,23.01 55.37,55.02 56.13,55.78 68.83,55.78 69.98,56.92 RELAY3.COIL0
COIL4
  Top 0.406: RELAY4.COIL0 86.87,74.64 R23.1
  Bottom 0.406: ULN2803.15 67.82,22 68.33,22.5 74.17,22.5 75.69,24.28 75.69,60.6 80.01,64.92 84.33,64.92 86.11,66.7 85.98,66.83 RELAY4.COIL0
COIL5  (via drill 0.6)
  Top 0.406: RELAY5.COIL0 102.87,74.8 R24.1 | v69.09,18.44 69.09,21.49 70.36,22.76 71.88,22.76 74.68,25.55 74.68,40.03 v78.99,44.35
  Bottom 0.406: ULN2803.14 v69.09,18.44 | v78.99,44.35 78.99,58.57 82.3,61.87 100.84,61.87 101.85,63.14 arc90 102.08,63.37 RELAY5.COIL0
COIL6  (via drill 0.6)
  Top 0.406: RELAY6.COIL0 119.13,74.8 R25.1 | v70.36,16.15 70.36,20.73 71.12,21.49 72.14,21.49 75.69,25.04 75.69,39.01 v81.03,44.35
  Bottom 0.406: ULN2803.13 v70.36,16.15 | v81.03,44.35 81.03,57.81 83.82,60.86 117.35,60.86 118.29,61.8 RELAY6.COIL0
COIL7  (via drill 0.6)
  Top 0.406: R26.1 135.13,75.05 RELAY7.COIL0 | v72.39,17.93 72.39,20.22 76.71,24.54 76.71,37.24 v81.79,42.32
  Bottom 0.406: ULN2803.12 71.63,18.69 v72.39,17.93 | v81.79,42.32 82.8,43.33 82.8,57.56 84.58,59.59 133.6,59.59 134.37,61.11 134.37,75.76 RELAY7.COIL0
COIL8
  Top 0.406: RELAY8.COIL0 151.13,75.05 R27.1
  Bottom 0.406: ULN2803.11 72.9,19.46 73.66,18.69 80.77,18.69 84.58,23.01 84.58,56.54 86.36,58.32 149.1,58.32 150.39,59.61 RELAY8.COIL0
GND  (via drill 0.6)
  Top 0.406: 138.94,60.6 OC8.3 | JDC0.1 JDC1.1 | S1.1 S1.2 112.52,11.07 111.76,11.84 91.69,11.84 90.93,10.82 J9.3 | IC1.10 61.47,43.59 58.93,41.05 IC1.17 | IC1.15 IC1.16 IC1.17 | v58.93,32.66 IC1.17 | OC2.3 v41.66,52.22 | v41.66,45.62 41.66,43.33 41.91,43.08 | OC3.3 54.41,58.88 v51.56,56.03 | C4.2 60.87,54.67 v59.44,53.24 | OC4.3 72.7,59.14 v72.14,58.57 | C6.2 90.17,56.29 v89.92,56.54 | OC6.3 106.68,57.05 106.17,56.54 v103.38,56.54 | C8.2 v121.16,55.78 | C9.2 v138.94,55.27 | 141.48,57.05 141.48,54.25
  Bottom 0.406: C1.- 21.77,9.55 U$1.3 21.77,17.17 JDC1.1 | ULN2803.9 74.17,24.28 73.41,23.52 68.07,23.52 66.8,22.25 63.45,22.25 62.74,22.83 62.74,30.12 61.72,31.14 59.69,31.14 58.93,31.9 v58.93,32.66 | NODEMCU.17 124.46,45.87 125.22,45.11 125.22,28.85 124.46,28.09 NODEMCU.24 116.59,28.09 115.32,26.82 S1.1 | J9.3 J10.3 | v41.66,52.22 v41.66,45.62 | v51.56,56.03 51.56,54.76 | v59.44,53.24 58.67,53.24 | v72.14,58.57 72.14,57.05 | v89.92,56.54 88.39,56.54 | v103.38,56.54 102.36,56.54 102.11,56.29 | v121.16,55.78 119.63,55.78 119.38,56.03
  pour Bottom (isolate 0.61): 0,44.09 17.27,44.09 17.53,44.09 21.84,48.41 21.84,60.6 164.08,60.86 164.08,0.41 0,0.41
  pour Top (isolate 0.61): 0,44.09 17.53,44.09 21.84,48.41 21.84,60.86 163.83,60.86 164.08,61.11 164.08,0.41 164.34,0.15 0.25,0.15 0,0.41
INTA
  Top 0.406: NODEMCU.20 119.63,38.25 115.57,42.32 115.57,45.87 113.54,47.9 75.95,47.9 74.42,46.38 74.42,44.6 72.9,43.08 64.26,43.08 62.74,41.55 IC1.20
INTB  (via drill 0.6)
  Top 0.406: NODEMCU.21 119.13,35.71 114.3,40.54 114.3,44.86 113.03,46.13 76.71,46.13 75.95,45.36 75.95,42.57 74.42,41.05 v68.07,41.05 | v61.47,32.66 IC1.19
  Bottom 0.406: v68.07,41.05 63.25,41.05 61.47,39.27 v61.47,32.66
L1
  Bottom 0.406: R4.1 28.3,79.1 29.26,80.06 30.07,80.06 | 30.07,80.06 31.37,80.06 | 30.07,80.06 30.89,80.87 30.89,79.25 30.07,80.06
  Bottom 1.676: JS1.2 31.37,80.06 31.37,73.47 RELAY1.SWCOMMON
L2
  Bottom 0.406: R6.1 44.45,78.89 45.47,79.91 46.23,79.91 | 46.23,79.91 47.53,79.91 | 46.23,79.91 46.99,80.67 46.99,79.15 46.23,79.91
  Bottom 1.676: JS2.2 47.53,79.91 47.53,73.63 RELAY2.SWCOMMON
L3
  Bottom 0.406: R8.1 60.71,78.89 61.72,79.91 62.48,79.91 | 62.48,79.91 62.74,79.91 | 62.74,79.91 63.72,79.91 63.98,79.65 | 62.74,79.91 63.25,80.42 | 62.48,79.91 63.25,79.15 63.25,79.65 62.99,79.65
  Bottom 1.676: JS3.2 63.98,96.53 63.98,79.65 RELAY3.SWCOMMON
L4
  Bottom 0.406: R10.1 76.71,79.15 77.72,80.16 78.49,80.16 | 78.49,80.16 79.84,80.16 | 78.49,80.16 78.99,80.67 78.99,79.65 | 78.99,79.65 78.49,80.16 | 78.99,79.65 79.25,79.4
  Bottom 1.676: JS4.2 79.84,80.16 79.84,73.68 RELAY4.SWCOMMON
L5
  Bottom 0.406: 94.74,80.16 93.98,80.16 93.22,79.4 R12.1 | 94.74,80.16 95,80.16 | 95,80.16 96.04,80.16 | 95,80.16 95.25,80.42 | 95.25,79.65 94.74,80.16 | 94.74,80.16 95.25,80.67
  Bottom 1.676: JS5.2 96.04,80.16 96.04,73.63 RELAY5.SWCOMMON
L6
  Bottom 0.406: R14.1 109.22,78.89 110.24,79.91 111,79.91 | 111,79.91 112.2,79.91 | 111,79.91 111.51,80.42 | 111,79.91 111.51,79.4
  Bottom 1.676: JS6.2 112.2,79.91 112.2,73.73 RELAY6.SWCOMMON
L7
  Bottom 0.406: R16.1 125.22,78.89 126.49,80.16 127,80.16 | 127,80.16 128.35,80.16 | 127.51,80.67 127,80.16 | 127,80.16 127.76,79.4
  Bottom 1.676: JS7.2 128.35,80.16 128.35,73.83 RELAY7.SWCOMMON
L8
  Bottom 0.406: R18.1 141.48,78.89 142.49,79.91 143.26,79.91 | 143.26,79.91 144.39,79.91 | 143.76,80.42 143.26,79.91 | 143.26,79.91 143.76,79.4
  Bottom 1.676: JS8.2 144.39,96.71 144.39,79.91 RELAY8.SWCOMMON
LIVE
  Top 1.676: AC_IN.2 14.96,93.86 9.4,88.29 5.84,88.29 4.06,86.51 3AG500R.1 4.06,83.46
LIVE_FUSE
  Top 0.813: U$1.1 8.38,52.17 8.38,60.1 | 8.38,60.1 8.38,61.11 8,61.49 8,61.75 | 8.38,60.1 7.62,60.86
  Top 1.676: 3AG500R.2 7.87,61.62 8,61.75 9.4,63.14 9.4,78.89 10.67,80.16 R1.1 15.75,80.16
N$1  (via drill 0.6)
  Top 0.406: v28.04,64.36 28.04,68.42 OC1.1
  Bottom 0.406: R4.2 28.3,64.87 v28.04,64.36
N$2  (via drill 0.6)
  Top 0.406: v44.45,64.41 44.2,64.41 OC2.1
  Bottom 0.406: R6.2 v44.45,64.41
N$3  (via drill 0.6)
  Top 0.406: v60.71,64.41 OC3.1
  Bottom 0.406: R8.2 v60.71,64.41
N$4
  Top 0.813: 8.38,60.6 8.38,61.37
N$5
  Top 0.406: D1.A 35.05,65.11 J1.1
N$6  (via drill 0.6)
  Top 0.406: v93.22,64.67 OC5.1
  Bottom 0.406: R12.2 v93.22,64.67
N$7  (via drill 0.6)
  Top 0.406: v108.97,64.41 108.97,68.17 OC6.1
  Bottom 0.406: R14.2 109.22,64.67 v108.97,64.41
N$8  (via drill 0.6)
  Top 0.406: v125.22,64.41 125.48,64.67 OC7.1
  Bottom 0.406: R16.2 v125.22,64.41
N$9  (via drill 0.6)
  Top 0.406: v76.71,64.67 76.96,64.67 OC4.1
  Bottom 0.406: R10.2 v76.71,64.67
N$10  (via drill 0.6)
  Top 0.406: v141.48,64.41 OC8.1
  Bottom 0.406: R18.2 v141.48,64.41
N$11
  Top 0.406: R20.2 37.76,66.63 D1.C
N$12
  Top 0.406: J2.1 51.56,65.06 D2.A
N$13
  Top 0.406: D2.C 54.47,67.01 R21.2
N$14
  Top 0.406: J3.1 67.82,65.06 D3.A
N$15
  Top 0.406: D3.C 70.73,67.01 R22.2
N$16
  Top 0.406: J4.1 84.07,65.06 D4.A
N$17
  Top 0.406: R23.2 86.98,67.26 D4.C
N$18
  Top 0.406: J5.1 99.82,65.06 D5.A
N$19
  Top 0.406: R24.2 102.87,64.05 D5.C
N$20
  Top 0.406: J6.1 115.82,65.06 D6.A
N$21
  Top 0.406: R25.2 118.99,66.73 D6.C
N$22
  Top 0.406: J7.1 132.33,64.55 D7.A
N$23
  Top 0.406: R26.2 135.13,63.79 D7.C
N$24
  Top 0.406: D8.A 148.08,64.55 J8.1
N$25
  Top 0.406: R27.2 150.99,66.98 D8.C
N$26  (via drill 0.6)
  Top 0.406: R28.2 115.99,17.84 114.81,16.66 91.19,16.66 90.68,16.15 v74.42,16.15 | v68.83,11.07 27.18,11.07 25.91,9.8 25.91,6.25 24.38,4.72 13.21,4.72 11.68,6.25 D9.C
  Bottom 0.406: v74.42,16.15 73.91,16.15 v68.83,11.07
N$27
  Top 0.813: 8.13,60.6 8.13,60.86 9.91,62.64 9.91,62.89
N$28
  Top 0.406: 40.64,69.49 41.66,69.49 41.91,69.24
N$29
  Top 0.406: 40.89,69.24 40.89,68.22 41.15,67.97
N$30
  Top 0.406: 22.61,81.43 19.3,84.73 19.3,85.24
N$31
  Top 0.406: 57.4,69.49 58.17,69.49 58.42,69.24
N$32
  Top 0.406: 57.15,69.24 57.15,68.48 57.4,68.22
N$33
  Top 0.406: 73.66,69.49 73.66,68.48 73.91,68.22
N$34
  Top 0.406: 73.41,69.75 74.42,69.75 74.68,69.49
N$35
  Top 0.406: 24.89,69.49 25.65,69.49 25.91,69.24 24.89,69.24 24.64,68.99 24.64,68.48 24.89,68.22
N$36
  Bottom 0.406: 95.25,79.91 95.25,79.65 95.5,79.4
N$37
  Top 0.406: 89.92,69.75 90.68,69.75 90.93,69.49
N$38
  Top 0.406: 89.92,69.49 89.92,68.48 90.17,68.22
N$39
  Top 0.406: 105.92,69.49 106.68,69.49 106.93,69.24 106.17,69.24 105.92,69.49 | 105.92,69.49 105.66,69.49 105.66,68.48 105.92,68.22
N$40
  Top 0.406: 123.19,69.24 122.94,69.49 122.43,69.49 122.17,69.49 121.92,69.49
N$41
  Top 0.406: 121.92,69.24 121.92,68.48 122.17,68.22
N$42
  Top 0.406: 138.68,69.49 137.92,69.49 137.92,68.48 138.18,68.22 | 138.68,69.49 138.94,69.49 139.19,69.24 138.94,69.24 138.68,69.49
N$43  (via drill 0.6)
  other vias: 1.78,76.86
N$44  (via drill 0.6)
  other vias: 4.06,76.86
N$45  (via drill 0.6)
  other vias: 6.35,76.86
N$46  (via drill 0.6)
  other vias: 6.35,74.83
N$47  (via drill 0.6)
  other vias: 6.35,73.05
N$48  (via drill 0.6)
  other vias: 6.35,71.02
N$49  (via drill 0.6)
  other vias: 6.35,68.99
N$50  (via drill 0.6)
  other vias: 4.06,68.99
N$51  (via drill 0.6)
  other vias: 1.78,68.99
N$52  (via drill 0.6)
  other vias: 1.78,71.02
N$53  (via drill 0.6)
  other vias: 1.78,73.05
N$54  (via drill 0.6)
  other vias: 1.78,74.83
N$55  (via drill 0.6)
  other vias: 4.06,74.83
N$56  (via drill 0.6)
  other vias: 4.06,73.05
N$57  (via drill 0.6)
  other vias: 4.06,71.02
N$58  (via drill 0.6)
  Top 0.406: 113.54,58.57 R15.2 113.63,61.32 113.54,61.32 | JDC0.2 JDC1.2 29.46,15.65 27.69,13.87 v19.81,13.87 | v14.73,13.87 12.84,13.87 D9.A | IC1.9 62.74,43.33 60.2,40.79 IC1.18 60.2,31.65 59.44,30.89 58.42,30.89 v57.15,32.16 | v35.81,45.87 37.34,47.4 R3.2 R2.2 49.02,44.86 v48.26,45.62 | v48.26,52.22 48.26,58.48 R7.2 48.35,61.02 arc90 48.26,61.11 47.75,61.11 | NODEMCU.16 143.76,48.41 145.8,50.44 145.8,58.48 R19.2 145.8,58.66 145.8,59.59 144.02,61.37 130.3,61.37 | R17.2 129.79,58.57 129.79,60.86 | 129.79,60.86 129.79,61.37 | 129.79,61.37 130.3,61.37 | 32.51,61.11 32.09,60.69 R5.2 32.09,61.11 32.51,61.11 | 32.51,61.11 64.77,61.2 | 64.77,61.2 81.02,61.24 | 81.02,61.24 97.53,61.28 | 97.53,61.28 113.54,61.32 | 113.54,61.32 129.79,61.37 | R13.2 97.62,61.28 97.53,61.28 | R11.2 81.11,61.24 81.02,61.24 | R9.2 64.86,61.2 64.77,61.2 | 32.51,61.11 47.5,61.11 | 47.5,61.11 47.75,61.11 | 47.75,61.11 48.51,60.35 | 48.51,60.35 49.02,60.86 | 48.51,60.86 49.02,60.86 | 49.28,61.11 49.02,60.86 | 48.51,60.35 48.26,60.35 47.5,61.11 | 130.3,61.37 129.79,60.86 | 129.79,60.86 129.29,61.37
  Bottom 0.406: v19.81,13.87 v14.73,13.87 | JDC0.2 29.46,24.03 29.97,24.54 35.31,24.54 35.81,25.04 v35.81,45.87 | v48.26,52.22 v48.26,45.62 50.55,43.33 50.55,16.92 51.82,15.65 56.39,15.65 57.15,16.41 v57.15,32.16
N$59
  Top 0.406: 64.26,61.11 64.77,60.6 | 64.77,60.6 65.28,61.11 | 64.77,60.6 65.02,60.6 65.53,61.11
N$60
  Top 0.406: 81.53,61.11 81.03,60.6 80.52,61.11 80.77,61.11
N$61
  Top 0.406: 98.04,61.11 97.79,60.86 97.54,60.86 97.28,61.11
N$62
  Top 0.406: 114.05,61.11 113.79,60.86 113.54,60.86 113.28,61.11
N$63
  Top 0.406: 141.73,55.52 141.48,55.78
N$64
  Bottom 0.406: 62.99,20.14 62.99,20.22 | 62.99,20.22 63.78,21.01 64.14,21.01 64.14,19.38 63.83,19.38 62.99,20.22 | 62.99,20.22 63.4,20.22 63.65,20.47 63.65,19.99 63.58,19.91 63.58,19.79 63.86,19.51
N$65
  Bottom 0.406: 63.65,19.38 62.28,19.38 62.26,19.41 62.64,19.41 62.99,19.76 63.09,19.76 63.25,19.61
NTRL
  Top 0.406: OC1.2 23.57,70.45 | 23.57,80.47 23.57,81.69 | 24.38,81.28 23.57,80.47 | 23.57,80.47 22.76,81.28 22.76,81.69 | OC2.2 39.88,70.2 39.88,80.42 | 39.88,80.42 39.88,81.69 | 39.88,80.42 39.12,81.18 | 39.88,80.42 40.39,80.92 | OC3.2 56.39,70.2 56.39,80.42 | 56.39,80.42 56.39,81.69 | 55.63,81.18 56.39,80.42 | 56.39,80.42 56.9,80.92 | OC4.2 72.39,70.71 72.39,80.42 | 72.39,80.42 72.39,81.69 | 72.39,80.42 71.88,80.92 72.9,80.92 | 72.9,80.92 72.39,80.42 | 72.9,80.92 73.15,81.18 | OC5.2 88.39,70.96 88.39,80.42 | 88.39,80.42 88.39,81.69 | 87.88,80.92 88.39,80.42 | 88.39,80.42 88.9,80.92 | OC6.2 104.39,70.71 104.39,80.42 | 104.39,80.42 104.39,81.69 | 104.9,80.92 104.39,80.42 | 104.39,80.42 103.89,80.92 | OC7.2 120.65,70.71 120.65,80.42 | 120.65,80.42 120.65,81.69 | 120.14,80.92 120.65,80.42 | 120.65,80.42 121.16,80.92 | OC8.2 136.65,70.71 136.65,80.42 | 136.65,80.42 136.65,81.69 | 137.16,80.92 136.65,80.42 | 136.65,80.42 136.14,80.92 | 137.16,80.92 137.16,81.43 | 137.16,80.92 137.41,81.18 137.41,81.94 137.16,82.19
  Top 0.813: 23.57,80.47 23.57,70.45 23.52,70.51 20.07,70.51 15.42,65.35 U$1.2
  Top 1.676: AC_IN.1 19.91,96.77 19.91,85.34 | 19.91,85.34 23.57,81.69 39.88,81.69 56.39,81.69 72.39,81.69 88.39,81.69 104.39,81.69 120.65,81.69 136.65,81.69 | R1.2 19.81,85.24 19.91,85.34
R1  (via drill 0.6)
  Top 0.406: v64.01,24.54 IC1.21
  Bottom 0.406: ULN2803.1 v64.01,24.54
R2  (via drill 0.6)
  Top 0.406: IC1.22 v65.28,38.25
  Bottom 0.406: v65.28,38.25 ULN2803.2
R3  (via drill 0.6)
  Top 0.406: v66.55,24.54 IC1.23
  Bottom 0.406: ULN2803.3 v66.55,24.54
R4  (via drill 0.6)
  Top 0.406: IC1.24 v67.82,38.25
  Bottom 0.406: v67.82,38.25 ULN2803.4
R5  (via drill 0.6)
  Top 0.406: v69.09,24.54 IC1.25
  Bottom 0.406: ULN2803.5 v69.09,24.54
R6  (via drill 0.6)
  Top 0.406: IC1.26 v70.36,38.25
  Bottom 0.406: v70.36,38.25 ULN2803.6
R7  (via drill 0.6)
  Top 0.406: v71.63,24.54 IC1.27
  Bottom 0.406: ULN2803.7 v71.63,24.54
R8  (via drill 0.6)
  Top 0.406: IC1.28 v72.9,38.25
  Bottom 0.406: v72.9,38.25 ULN2803.8
S1A
  Bottom 1.676: JS1.3 26.37,88.29 RELAY1.SWOPEN
S1B
  Bottom 1.676: JS1.1 36.37,88.47 RELAY1.SWCLOSED
S2A
  Bottom 1.676: JS2.3 42.53,88.24 RELAY2.SWOPEN
S2B
  Bottom 1.676: JS2.1 52.53,88.63 RELAY2.SWCLOSED
S3A
  Bottom 1.676: JS3.3 58.68,88.19 RELAY3.SWOPEN
S3B
  Bottom 1.676: JS3.1 68.68,88.78 RELAY3.SWCLOSED
S4A
  Bottom 1.676: JS4.3 74.84,88.39 RELAY4.SWOPEN
S4B
  Bottom 1.676: JS4.1 84.84,88.68 RELAY4.SWCLOSED
S5A
  Bottom 1.676: JS5.3 91.04,88.55 RELAY5.SWOPEN
S5B
  Bottom 1.676: JS5.1 101.04,88.63 RELAY5.SWCLOSED
S6A
  Bottom 1.676: JS6.3 107.2,88.55 RELAY6.SWOPEN
S6B
  Bottom 1.676: JS6.1 117.2,88.73 RELAY6.SWCLOSED
S7A
  Bottom 1.676: JS7.3 123.35,88.75 RELAY7.SWOPEN
S7B
  Bottom 1.676: JS7.1 133.35,88.83 RELAY7.SWCLOSED
S8A
  Bottom 1.676: JS8.3 139.5,88.9 RELAY8.SWOPEN
S8B
  Bottom 1.676: JS8.1 149.5,88.68 RELAY8.SWCLOSED
S$2
  Top 0.813: 23.62,70.51 24.89,69.24
SCL
  Top 0.406: R3.1 58.93,47.4 IC1.12 58.93,42.82 54.86,38.76 54.86,30.89 55.88,29.87 61.72,29.87 62.74,28.85 62.74,22.5 68.07,17.17 68.07,14.88 68.83,14.12 92.46,14.12 93.73,15.39 NODEMCU.29
SDA
  Top 0.406: R2.1 53.43,43.84 53.59,43.84 | 53.59,43.84 57.15,43.84 57.66,44.35 IC1.13 | NODEMCU.28 124.46,17.93 125.98,16.41 125.98,12.34 124.21,10.57 120.9,10.57 117.6,13.87 95,13.87 93.47,13.11 65.53,13.11 64.01,14.63 55.63,14.63 50.8,19.46 50.8,21.74 53.59,24.54 53.59,43.84
SNS1
  Top 0.406: OC1.4 28.5,58.52 R5.1 30.39,56.62 C2.1 29.97,55.97 29.97,50.44 31.24,49.17 61.98,49.17 64.01,47.14 IC1.8
SNS2
  Top 0.406: OC2.4 44.51,58.57 R7.1 46.65,56.62 46.23,56.2 | C3.1 46.23,56.2 | IC1.7 65.28,48.16 62.48,50.7 47.5,50.7 46.23,51.71 46.23,56.2
SNS3
  Top 0.406: OC3.4 60.71,58.32 R9.1 63.16,56.36 C4.1 62.57,53.91 66.55,50.44 IC1.6
SNS4
  Top 0.406: OC4.4 79.1,59.14 R11.1 79.41,57.13 C5.1 78.49,56.2 78.49,54.76 77.72,54 71.37,54 67.82,50.44 IC1.5
SNS5
  Top 0.406: OC5.4 93.53,58.83 R13.1 95.92,57.38 C6.1 94.74,56.2 94.74,55.02 94.23,54.51 80.01,54.51 78.23,52.73 71.63,52.73 69.09,50.19 IC1.4
SNS6
  Top 0.406: OC6.4 109.53,58.57 R15.1 111.76,58.41 111.76,57.05 110.83,56.12 C7.1 110.74,55.94 110.74,55.27 110.24,54.76 95.76,54.76 94.49,53.49 80.77,53.49 78.74,51.46 72.14,51.46 70.36,49.68 IC1.3
SNS7
  Top 0.406: OC7.4 125.79,58.57 R17.1 128.18,56.87 C8.1 127.25,55.78 127.25,54 126.75,53.49 95.76,53.49 94.74,52.48 81.53,52.48 79.5,50.44 72.9,50.44 71.63,49.17 IC1.2
SNS8
  Top 0.406: OC8.4 141.79,58.57 R19.1 144.18,56.87 C9.1 143.09,53.07 142.49,52.48 96.27,52.48 95.25,51.46 82.04,51.46 80.01,49.43 73.66,49.43 72.9,48.67 IC1.1
SW1
  Top 0.406: NODEMCU.23 129.29,30.63 130.05,29.87 130.05,10.82 122.68,3.45 S1.4 115.32,2.44 114.3,1.42 101.09,1.42 99.82,2.69 99.82,4.72 99.06,5.49 93.98,5.49 93.47,4.98 J10.2
SW2
  Top 0.406: S1.3 103.38,3.45 100.33,6.5 94.49,6.5 93.47,7.52 J9.2
  Bottom 0.406: S1.3 112.78,5.23 110.49,7.52 110.49,30.12 113.54,33.17 NODEMCU.22
SYS_LED
  Top 0.406: NODEMCU.27 R28.1
VCC  (via drill 0.6)
  Top 0.406: RELAY1.COIL1 28.25,75.38 28.85,74.78 28.85,71.93 30.07,70.71 31.7,70.71 32.51,69.9 J1.2 32.51,64.67 34.54,62.64 45.97,62.64 | RELAY2.COIL1 44.35,75.43 44.96,74.83 44.96,72.03 45.97,71.02 48.01,71.02 49.02,70 J2.2 49.02,67.72 46.48,65.18 46.48,63.14 | 45.97,62.64 46.48,63.14 | RELAY3.COIL1 60.3,75.48 61.21,74.57 61.21,72.29 62.48,71.02 64.26,71.02 65.28,70 J3.2 65.28,67.97 62.99,65.68 62.99,63.14 | 62.99,63.14 62.99,62.64 | 46.99,62.64 45.97,62.64 | 46.48,63.14 46.99,62.64 | RELAY4.COIL1 76.26,75.53 77.22,74.57 77.22,72.54 78.49,71.27 80.52,71.27 81.53,70.26 J4.2 81.53,68.22 79.25,65.94 79.25,63.14 | 79.25,63.14 79.25,62.64 | 63.5,62.64 62.99,62.64 | 62.99,62.64 62.48,62.64 | 62.48,62.64 46.99,62.64 | 62.48,62.64 62.99,63.14 | 62.99,63.14 63.5,62.64 | RELAY5.COIL1 92.21,75.59 93.22,74.57 93.22,72.8 95,71.02 96.27,71.02 97.28,70 J5.2 97.28,67.97 95.25,65.94 95.25,63.14 | 95.25,63.14 95.25,62.64 | 79.76,62.64 79.25,62.64 | 79.25,62.64 78.74,62.64 | 78.74,62.64 63.5,62.64 | 78.74,62.64 79.25,63.14 | 79.25,63.14 79.76,62.64 | RELAY6.COIL1 108.16,75.64 109.22,74.57 109.22,72.8 111.25,70.76 112.52,70.76 113.28,70 J6.2 111.51,66.45 111.51,63.14 | 111.51,62.89 111.51,62.64 | 95.76,62.64 95.25,62.64 | 95.25,62.64 94.74,62.64 | 94.74,62.64 79.76,62.64 | 94.74,62.64 95.25,63.14 | 95.25,63.14 95.76,62.64 | RELAY7.COIL1 124.01,75.79 125.22,74.57 125.22,73.3 127.51,71.02 128.52,71.02 129.79,69.75 J7.2 129.79,67.72 127.76,65.68 127.76,63.4 | 127.76,63.4 127.76,62.64 | 127.13,62.76 127,62.64 | 127,62.64 112.01,62.64 | 112.01,62.64 111.76,62.64 | 111.76,62.64 111.51,62.64 | 111.51,62.64 111,62.64
  Top 0.406: 111,62.64 95.76,62.64 | 111,62.64 111.51,63.14 | 111.51,63.14 111.51,62.89 | 111.51,62.89 111.76,62.64 | 111.51,63.14 112.01,62.64 | 140.52,75.79 141.48,74.83 141.48,72.8 143.51,70.76 144.53,70.76 145.54,69.75 J8.2 145.54,67.72 143.76,65.94 143.76,63.91 | 140.52,75.79 RELAY8.COIL1 138.45,75.84 140.46,75.84 140.52,75.79 | 143.76,63.91 143.76,63.65 143.26,63.14 | 143.26,63.14 142.75,62.64 | 142.75,62.64 128.52,62.64 | 128.27,62.64 127.76,62.64 | 127.76,62.64 127.25,62.64 | 127.25,62.64 127.13,62.76 | 127.25,62.64 127,62.64 | 127.13,62.76 127.51,63.14 | 127.51,62.89 127.51,63.14 | 127.51,63.14 127.76,63.4 | 127.76,63.4 128.52,62.64 | 128.52,62.64 128.27,62.64 | 128.27,62.64 128.02,62.89 | C1.+ 18.54,11.58 | 18.54,12.34 18.54,12.85 | 18.54,13.11 14.46,17.18 U$1.4 | NODEMCU.15 150.37,48.67 150.37,59.84 148.34,61.87 145.8,61.87 145.03,62.64 | 145.03,62.64 144.53,63.14 | 144.53,63.14 143.76,63.91 | 144.53,63.14 143.51,63.14 143.76,63.4 144.02,63.4 | 144.27,63.14 143.26,63.14 | 142.75,62.64 143.51,62.64 | 145.03,62.64 143.51,62.64 | 143.51,62.64 143.26,62.89 144.53,62.89 | v32,45.87 JDC0.3 JDC1.3 32,14.88 29.46,12.34 19.3,12.34 | v77.72,20.73 82.04,20.73 84.07,18.69 v96.01,18.69 | 19.05,12.34 18.54,12.34 | 19.3,12.34 18.54,13.11 | 18.54,13.11 18.54,12.85 | 18.54,12.85 18.8,12.6 18.54,12.34 | 18.54,12.34 18.54,11.58 | 18.54,11.58 19.3,12.34 | 19.3,12.34 19.05,12.34 | 19.05,12.34 18.8,12.09
  Bottom 0.406: ULN2803.10 77.22,23.77 | 77.22,23.77 77.22,59.59 80.77,63.14 96.27,63.14 97.28,64.16 J5.2 | J10.1 J9.1 v96.01,18.69 | v32,45.87 32.51,46.38 J1.2 | 77.22,23.77 77.21,23.77 75.44,22 | 75.44,22 74.17,20.73 75.44,20.73 | 75.44,20.73 75.69,20.73 | 75.69,20.73 v77.72,20.73 | 75.44,22 75.44,21.23 | 75.44,20.73 75.44,21.23 | 75.44,21.23 75.18,21.49 75.18,20.98 74.93,20.98 74.93,21.23 74.68,20.98 74.68,20.73 74.42,20.47 75.44,20.47 75.69,20.73 | 75.69,20.73 75.69,22

### Text on the board
Top: S.M.A.R.T / Rev 1.0